# Altium schematic sheet Sheet3.SchDoc
size A3
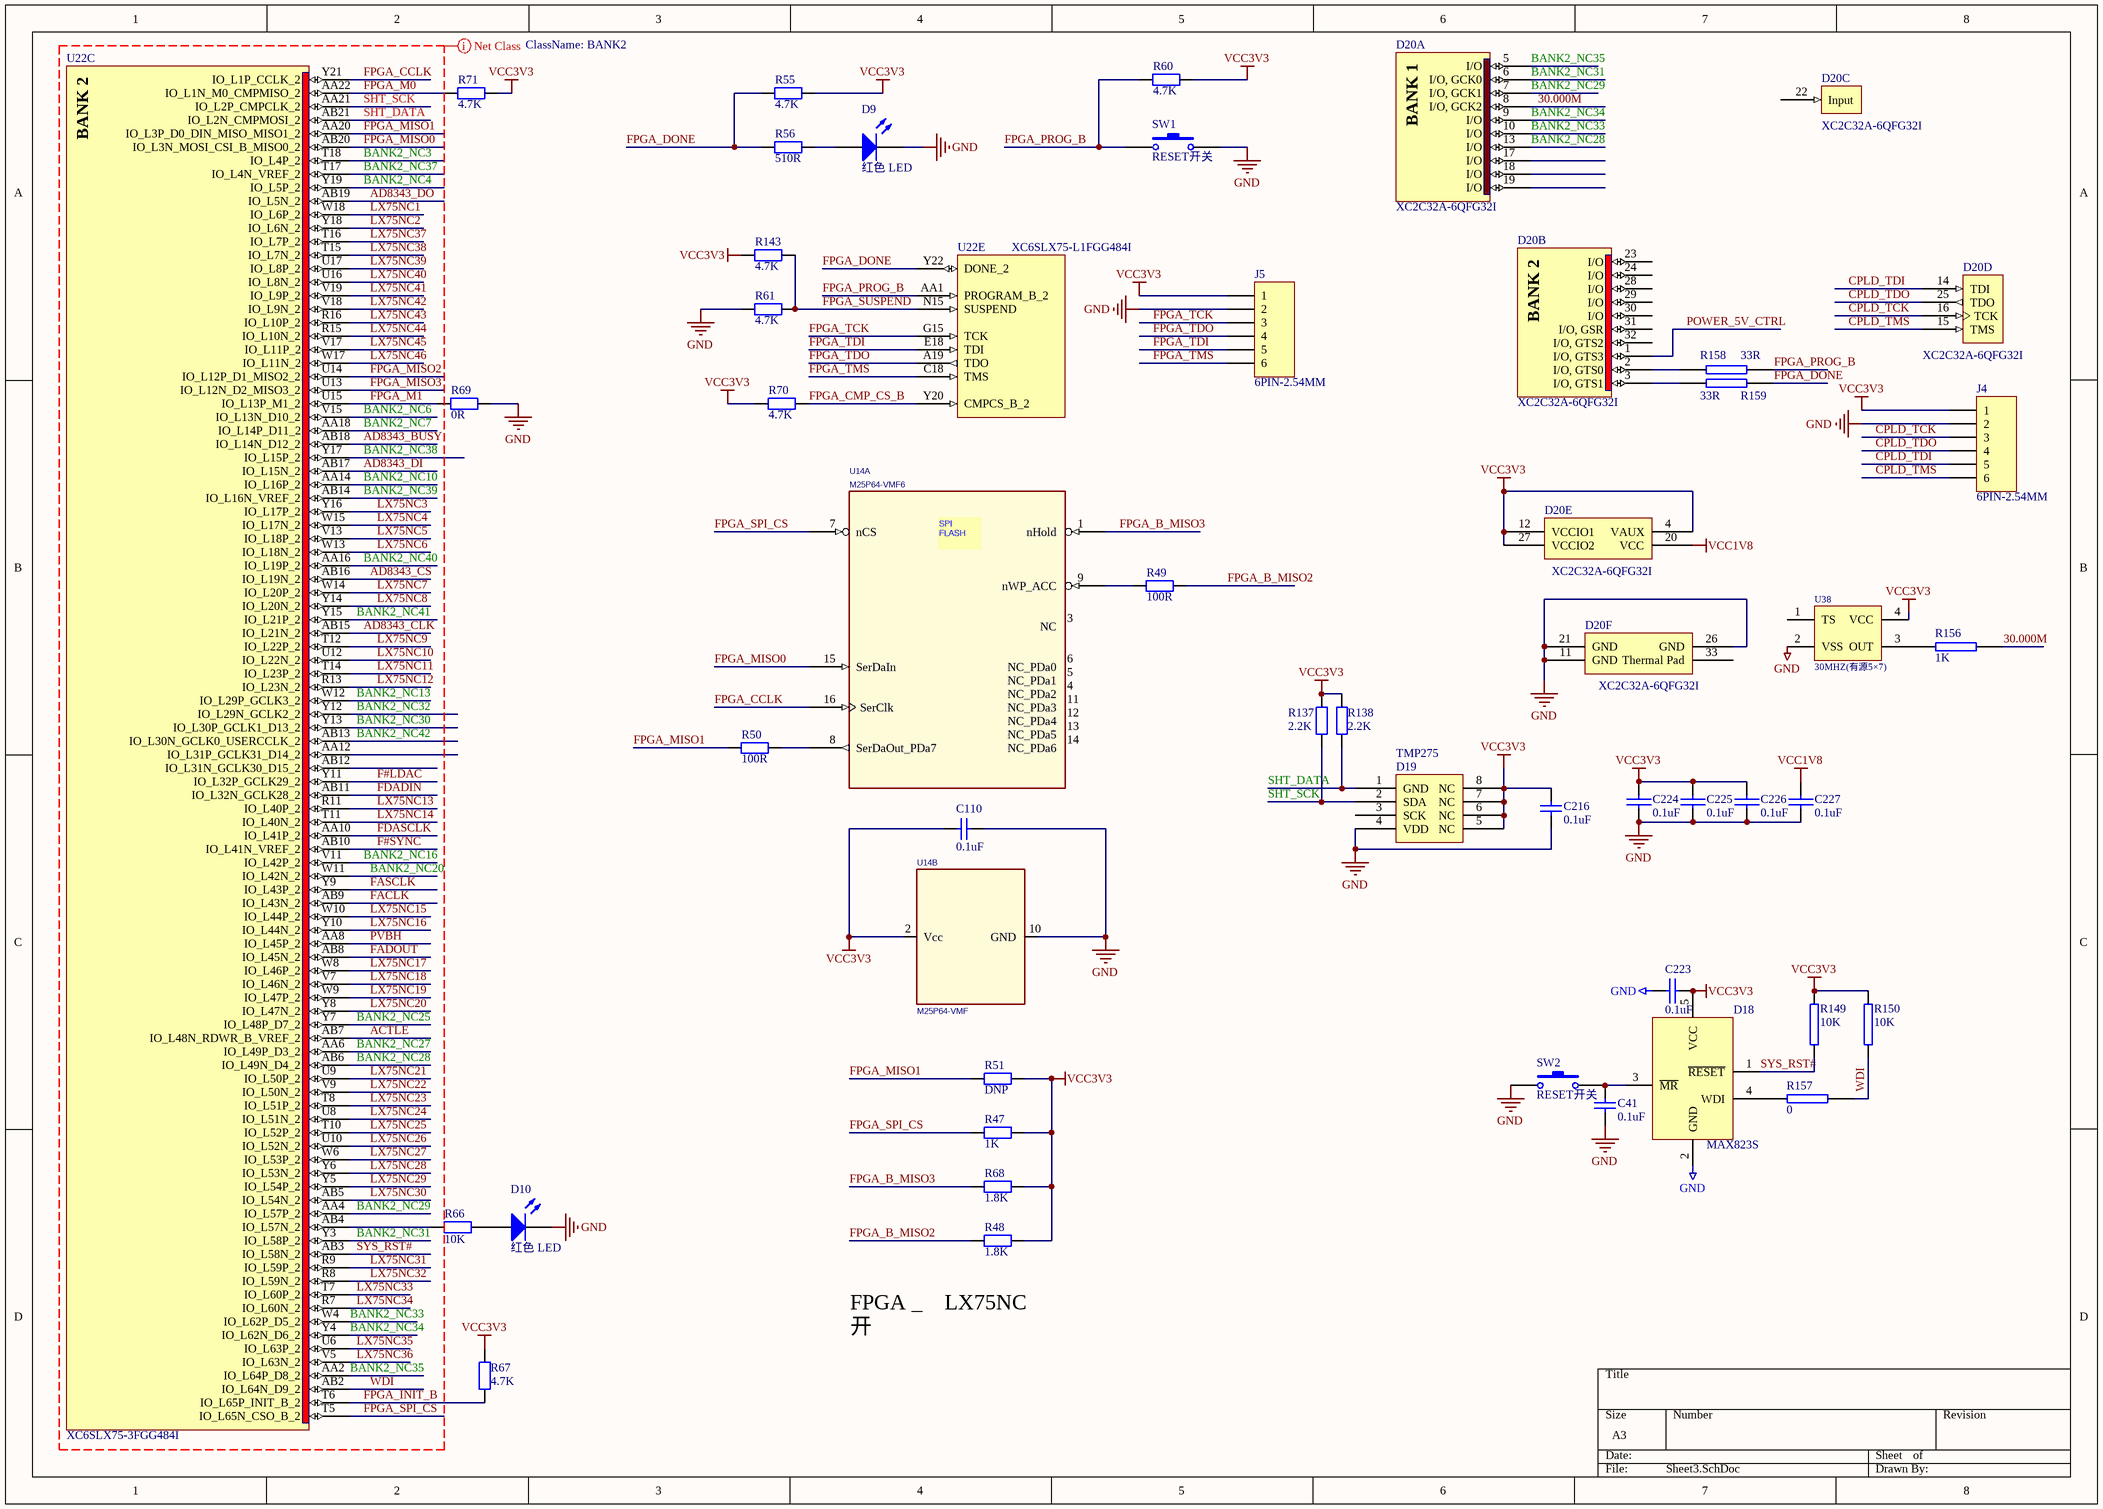
[diagram p0: Sheet3.SchDoc]

## Parts
C41  0.1uF  [0603C]
C110  0.1uF  [0402C]
C216  0.1uF  [0402C]
C223  0.1uF  [0603X]
C224  0.1uF  [0402C]
C225  0.1uF  [0402C]
C226  0.1uF  [0402C]
C227  0.1uF  [0402C]
D9  红色 LED  [0805LED]
D10  红色 LED  [0805LED]
D18  MAX823S  [MAX823]
D19  TMP275  [SMD8XX]
D20  XC2C32A-6QFG32I  [QFG32_N]  (parts A,B,C,D,E,F of 6)
J4  6PIN-2.54MM  [SIP6X]
J5  6PIN-2.54MM  [SIP6X]
R47  1K  [0603R]
R48  1.8K  [0603R]
R49  100R  [0603R]
R50  100R  [0603R]
R51  DNP  [0603R]
R55  4.7K  [0603R]
R56  510R  [0603R]
R60  4.7K  [0603R]
R61  4.7K  [0603R]
R66  10K  [0603R]
R67  4.7K  [0603R]
R68  1.8K  [0603R]
R69  0R  [0603R]
R70  4.7K  [0603R]
R71  4.7K  [0603R]
R137  2.2K  [0603R]
R138  2.2K  [0603R]
R143  4.7K  [0603R]
R149  10K  [0603X]
R150  10K  [0603X]
R156  1K  [0603]
R157  0  [0603]
R158  33R  [0603R]
R159  33R  [0603R]
SW1  RESET开关  [RESETKEY]
SW2  RESET开关  [RESETKEY]
U14  M25P64-VMF6  [SOIC16]  (parts A,B of 2)
U22  XC6SLX75-3FGG484I  [FGG484]  (parts C,E of 8)
U38  30MHZ(有源5×7)  [30M]

## Nets
GND: C41.1 C110.1 C216.1 C223.1 C224.1 C225.1 C226.1 C227.1 D9.2(K) D10.2(K) D18.2(GND) D19.4(VDD) D20.11(GND) D20.21(GND) D20.26(GND) J4.2 J5.2 R61.1 R69.1 SW1.2 SW2.1 U14.10(GND) U38.2(VSS)
VCC1V8: C227.2 D20.20(VCC)
VCC3V3: C110.2 C216.2 C223.2 C224.2 C225.2 C226.2 D18.5(VCC) D19.5(NC) D19.6(NC) D19.7(NC) D19.8(NC) D20.4(VAUX) D20.12(VCCIO1) D20.27(VCCIO2) J4.1 J5.1 R47.2 R48.2 R51.2 R55.2 R60.2 R67.1 R68.2 R70.1 R71.1 R137.1 R138.1 R143.1 R149.2 R150.2 U14.2(Vcc) U38.4(VCC)
30.000M: D20.8(I/O,_GCK2) R156.2
ACTLE: U22.AB7(IO_L48N_RDWR_B_VREF_2)
AD8343_BUSY: U22.AB18(IO_L14N_D12_2)
AD8343_CLK: U22.AB15(IO_L21N_2)
AD8343_CS: U22.AB16(IO_L19N_2)
AD8343_DI: U22.AB17(IO_L15N_2)
AD8343_DO: U22.AB19(IO_L5N_2)
BANK2_NC3: U22.T18(IO_L4P_2)
BANK2_NC4: U22.Y19(IO_L5P_2)
BANK2_NC6: U22.V15(IO_L13N_D10_2)
BANK2_NC7: U22.AA18(IO_L14P_D11_2)
BANK2_NC10: U22.AA14(IO_L16P_2)
BANK2_NC13: U22.W12(IO_L29P_GCLK3_2)
BANK2_NC16: U22.V11(IO_L42P_2)
BANK2_NC20: U22.W11(IO_L42N_2)
BANK2_NC25: U22.Y7(IO_L48P_D7_2)
BANK2_NC27: U22.AA6(IO_L49P_D3_2)
BANK2_NC28: D20.13(I/O) U22.AB6(IO_L49N_D4_2)
BANK2_NC29: D20.7(I/O,_GCK1) U22.AA4(IO_L57P_2)
BANK2_NC30: U22.Y13(IO_L30P_GCLK1_D13_2)
BANK2_NC31: D20.6(I/O,_GCK0) U22.Y3(IO_L58P_2)
BANK2_NC32: U22.Y12(IO_L29N_GCLK2_2)
BANK2_NC33: D20.10(I/O) U22.W4(IO_L62P_D5_2)
BANK2_NC34: D20.9(I/O) U22.Y4(IO_L62N_D6_2)
BANK2_NC35: D20.5(I/O) U22.AA2(IO_L64P_D8_2)
BANK2_NC37: U22.T17(IO_L4N_VREF_2)
BANK2_NC38: U22.Y17(IO_L15P_2)
BANK2_NC39: U22.AB14(IO_L16N_VREF_2)
BANK2_NC40: U22.AA16(IO_L19P_2)
BANK2_NC41: U22.Y15(IO_L21P_2)
BANK2_NC42: U22.AB13(IO_L30N_GCLK0_USERCCLK_2)
CPLD_TCK: D20.16(TCK) J4.3
CPLD_TDI: D20.14(TDI) J4.5
CPLD_TDO: D20.25(TDO) J4.4
CPLD_TMS: D20.15(TMS) J4.6
F#LDAC: U22.Y11(IO_L32P_GCLK29_2)
F#SYNC: U22.AB10(IO_L41N_VREF_2)
FACLK: U22.AB9(IO_L43N_2)
FADOUT: U22.AB8(IO_L45N_2)
FASCLK: U22.Y9(IO_L43P_2)
FDADIN: U22.AB11(IO_L32N_GCLK28_2)
FDASCLK: U22.AA10(IO_L41P_2)
FPGA_B_MISO2: R48.1 R49.2
FPGA_B_MISO3: R68.1 U14.1(nHold)
FPGA_CCLK: U14.16(SerClk) U22.Y21(IO_L1P_CCLK_2)
FPGA_CMP_CS_B: R70.2 U22.Y20(CMPCS_B_2)
FPGA_DONE: R55.1 R56.1 R159.2 U22.Y22(DONE_2)
FPGA_INIT_B: R67.2 U22.T6(IO_L65P_INIT_B_2)
FPGA_M0: R71.2 U22.AA22(IO_L1N_M0_CMPMISO_2)
FPGA_M1: R69.2 U22.U15(IO_L13P_M1_2)
FPGA_MISO0: U14.15(SerDaIn) U22.AB20(IO_L3N_MOSI_CSI_B_MISO0_2)
FPGA_MISO1: R50.1 R51.1 U22.AA20(IO_L3P_D0_DIN_MISO_MISO1_2)
FPGA_MISO2: U22.U14(IO_L12P_D1_MISO2_2)
FPGA_MISO3: U22.U13(IO_L12N_D2_MISO3_2)
FPGA_PROG_B: R60.1 R158.2 SW1.1 U22.AA1(PROGRAM_B_2)
FPGA_SPI_CS: R47.1 U14.7(nCS) U22.T5(IO_L65N_CSO_B_2)
FPGA_SUSPEND: R61.2 R143.2 U22.N15(SUSPEND)
FPGA_TCK: J5.3 U22.G15(TCK)
FPGA_TDI: J5.5 U22.E18(TDI)
FPGA_TDO: J5.4 U22.A19(TDO)
FPGA_TMS: J5.6 U22.C18(TMS)
LX75NC1: U22.W18(IO_L6P_2)
LX75NC2: U22.Y18(IO_L6N_2)
LX75NC3: U22.Y16(IO_L17P_2)
LX75NC4: U22.W15(IO_L17N_2)
LX75NC5: U22.V13(IO_L18P_2)
LX75NC6: U22.W13(IO_L18N_2)
LX75NC7: U22.W14(IO_L20P_2)
LX75NC8: U22.Y14(IO_L20N_2)
LX75NC9: U22.T12(IO_L22P_2)
LX75NC10: U22.U12(IO_L22N_2)
LX75NC11: U22.T14(IO_L23P_2)
LX75NC12: U22.R13(IO_L23N_2)
LX75NC13: U22.R11(IO_L40P_2)
LX75NC14: U22.T11(IO_L40N_2)
LX75NC15: U22.W10(IO_L44P_2)
LX75NC16: U22.Y10(IO_L44N_2)
LX75NC17: U22.W8(IO_L46P_2)
LX75NC18: U22.V7(IO_L46N_2)
LX75NC19: U22.W9(IO_L47P_2)
LX75NC20: U22.Y8(IO_L47N_2)
LX75NC21: U22.U9(IO_L50P_2)
LX75NC22: U22.V9(IO_L50N_2)
LX75NC23: U22.T8(IO_L51P_2)
LX75NC24: U22.U8(IO_L51N_2)
LX75NC25: U22.T10(IO_L52P_2)
LX75NC26: U22.U10(IO_L52N_2)
LX75NC27: U22.W6(IO_L53P_2)
LX75NC28: U22.Y6(IO_L53N_2)
LX75NC29: U22.Y5(IO_L54P_2)
LX75NC30: U22.AB5(IO_L54N_2)
LX75NC31: U22.R9(IO_L59P_2)
LX75NC32: U22.R8(IO_L59N_2)
LX75NC33: U22.T7(IO_L60P_2)
LX75NC34: U22.R7(IO_L60N_2)
LX75NC35: U22.U6(IO_L63P_2)
LX75NC36: U22.V5(IO_L63N_2)
LX75NC37: U22.T16(IO_L7P_2)
LX75NC38: U22.T15(IO_L7N_2)
LX75NC39: U22.U17(IO_L8P_2)
LX75NC40: U22.U16(IO_L8N_2)
LX75NC41: U22.V19(IO_L9P_2)
LX75NC42: U22.V18(IO_L9N_2)
LX75NC43: U22.R16(IO_L10P_2)
LX75NC44: U22.R15(IO_L10N_2)
LX75NC45: U22.V17(IO_L11P_2)
LX75NC46: U22.W17(IO_L11N_2)
POWER_5V_CTRL: D20.1(I/O,_GTS3)
PVBH: U22.AA8(IO_L45P_2)
SHT_DATA: D19.1(GND) R138.2 U22.AB21(IO_L2N_CMPMOSI_2)
SHT_SCK: D19.2(SDA) R137.2 U22.AA21(IO_L2P_CMPCLK_2)
SYS_RST#: D18.1(~{RESET}) R149.1 U22.AB3(IO_L58N_2)
WDI: R150.1 R157.2 U22.AB2(IO_L64N_D9_2)
NetC41_2: C41.2 D18.3(~{MR}) SW2.2
NetD9_1: D9.1(A) R56.2
NetD10_1: D10.1(A) R66.2
NetD18_4: D18.4(WDI) R157.1
NetD20_2: D20.2(I/O,_GTS0) R158.1
NetD20_3: D20.3(I/O,_GTS1) R159.1
NetR49_1: R49.1 U14.9(nWP_ACC)
NetR50_2: R50.2 U14.8(SerDaOut_PDa7)
NetR66_1: R66.1 U22.AB4(IO_L57N_2)
NetR156_1: R156.1 U38.3(OUT)

Not connected (* = marked no-connect by the designer): D19 3(SCK); D20 17(I/O) 18(I/O) 19(I/O) 22(Input) 23(I/O) 24(I/O) 28(I/O) 29(I/O) 30(I/O) 31(I/O,_GSR) 32(I/O,_GTS2) 33(Thermal_Pad); U14 3(NC) 4(NC_PDa2) 5(NC_PDa1) 6(NC_PDa0) 11(NC_PDa3) 12(NC_PDa4) 13(NC_PDa5) 14(NC_PDa6); U22 AA12(IO_L31P_GCLK31_D14_2) AB12(IO_L31N_GCLK30_D15_2); U38 1(TS)

## Layout directives
net class BANK2: ACTLE, AD8343_BUSY, AD8343_CLK, AD8343_CS, AD8343_DI, AD8343_DO, BANK2_NC3, BANK2_NC4, BANK2_NC6, BANK2_NC7, BANK2_NC10, BANK2_NC13, BANK2_NC16, BANK2_NC20, BANK2_NC25, BANK2_NC27, BANK2_NC28, BANK2_NC29, BANK2_NC30, BANK2_NC31, BANK2_NC32, BANK2_NC33, BANK2_NC34, BANK2_NC35, BANK2_NC37, BANK2_NC38, BANK2_NC39, BANK2_NC40, BANK2_NC41, BANK2_NC42, F#LDAC, F#SYNC, FACLK, FADOUT, FASCLK, FDADIN, FDASCLK, FPGA_CCLK, FPGA_INIT_B, FPGA_M0, FPGA_M1, FPGA_MISO0, FPGA_MISO1, FPGA_MISO2, FPGA_MISO3, FPGA_SPI_CS, LX75NC1, LX75NC2, LX75NC3, LX75NC4, LX75NC5, LX75NC6, LX75NC7, LX75NC8, LX75NC9, LX75NC10, LX75NC11, LX75NC12, LX75NC13, LX75NC14, LX75NC15, LX75NC16, LX75NC17, LX75NC18, LX75NC19, LX75NC20, LX75NC21, LX75NC22, LX75NC23, LX75NC24, LX75NC25, LX75NC26, LX75NC27, LX75NC28, LX75NC29, LX75NC30, LX75NC31, LX75NC32, LX75NC33, LX75NC34, LX75NC35, LX75NC36, LX75NC37, LX75NC38, LX75NC39, LX75NC40, LX75NC41, LX75NC42, LX75NC43, LX75NC44, LX75NC45, LX75NC46, PVBH, SHT_DATA, SHT_SCK, SYS_RST#, WDI

## Notes on the sheet
- (near R48) FPGA _    LX75NC 开
- (in symbol SPI FLASH 128Mb S25FL128P, part A) SPI / FLASH
- (in symbol XC2C32A-6QFG32C, part A) BANK 1
- (in symbol XC2C32A-6QFG32C, part B) BANK 2
- (in symbol XC6SLX45-L1FGG484I, part C) BANK 2

## Library data of the parts
C41 C110 C216 = Cap: Capacitor; Published: 8-Jun-2000; LatestRevisionDate: 17-Jul-2002; LatestRevisionNote: Re-released for DXP Platform.; PackageReference: RAD-0.3; Publisher: Altium Limited; Value: 0.1uF
C223-C227 = 2543.S01_104_49
D9 = LED2: Typical RED, GREEN, YELLOW, AMBER GaAs LED; Published: 8-Jun-2000; LatestRevisionDate: 17-Jul-2002; LatestRevisionNote: Re-released for DXP Platform.; PackageVersion: Feb-2002; PackageReference: 3.2X1.6X1.1; Publisher: Altium Limited
D10 = LED0: Typical INFRARED GaAs LED; Published: 8-Jun-2000; LatestRevisionDate: 08-Jul-2005; LatestRevisionNote: Mech Layer 1 removed.; PackageReference: LED-0; Publisher: Altium Limited
D18 = MAX823: MAX823复位监控芯片
D19 = SHT11
D20 = XC2C32A-6QFG32C: CoolRunner-II 1.8V, 32 Macrocell CPLD, 21 User I/Os, 32-Pin QFNL, Commercial Grade, Pb-Free; FirstPublished: 8-Jul-2005; LatestRevisionDate: 30-Oct-2009; LatestRevisionNote: Updated to datasheet version 3.1 Sep-2008.; DatasheetVersion: ver2.1, Nov-2008; PackageVersion: ver1.0, Aug-2004; PackageReference: QFG32; Publisher: Altium Limited; PackageDescription: 32-Pin Quad Flat No-Lead (QFG32) - Pb-Free; Supplier 1: Digi-Key; Supplier Part Number 1: 122-1412-ND; Code_JEDEC: MO-220; ComponentLink1Description: XC2C32A Datasheet; ComponentLink1URL: http://www.xilinx.com/support/documentation/data_sheets/ds310.pdf; ComponentLink2Description: QFG32 Package Drawing; ComponentLink2URL: http://www.xilinx.com/support/documentation/package_specs/qfg32.pdf; ComponentLink3Description: CoolRunner-II Documents; ComponentLink3URL: http://www.xilinx.com/support/documentation/coolrunner-ii.htm; ComponentLink4Description: Xilinx.com Home; ComponentLink4URL: http://www.xilinx.com
J4 J5 = Header 6: Header, 6-Pin; LatestRevisionDate: 17-Jul-2002; LatestRevisionNote: Re-released for DXP Platform.; Publisher: Altium Limited
R47-R51 R55 R60 R61 R66-R70 R143 = Res2: Resistor; Published: 8-Jun-2000; LatestRevisionDate: 17-Jul-2002; LatestRevisionNote: Re-released for DXP Platform.; PackageReference: AXIAL-0.4; Publisher: Altium Limited
  R47: Value: 1K
  R48 R68: Value: 1.8K
  R49 R50: Value: 100R
  R51: Value: DNP
  R55 R60 R61 R67 R70 R143: Value: 4.7K
  R66: Value: 10K
  R69: Value: 0R
R56 = Res2: Resistor; Value: 510; Published: 8-Jun-2000; LatestRevisionDate: 17-Jul-2002; LatestRevisionNote: Re-released for DXP Platform.; PackageReference: AXIAL-0.4; Publisher: Altium Limited
R71 = Res2: Resistor; Value: 4K7; Published: 8-Jun-2000; LatestRevisionDate: 17-Jul-2002; LatestRevisionNote: Re-released for DXP Platform.; PackageReference: AXIAL-0.4; Publisher: Altium Limited
R137 R138 = Res2: Resistor; Value: 100R; Published: 8-Jun-2000; LatestRevisionDate: 17-Jul-2002; LatestRevisionNote: Re-released for DXP Platform.; PackageReference: AXIAL-0.4; Publisher: Altium Limited
R149 R150 = RES2: 电阻
R156-R159 = RES2
SW1 SW2 = SW-PB: Switch; Published: 24-Mar-1999; LatestRevisionDate: 17-Jul-2002; LatestRevisionNote: Re-released for DXP Platform.; PackageReference: SPST-2; Publisher: Altium Limited
U14 = SPI FLASH 128Mb S25FL128P: SPI FLASH 128Mbit, 104MHz, 64kB sector; Full Part No: S25FL128P0XMFI00; Manufacturer: Spansion; Volts: 3.3V; ALS Lib: L0505; CLASS: IC; Type: SPI; Case: SOIC16
U22 = XC6SLX45-L1FGG484I: Spartan-6 LX 1.0V FPGA, 316 User I/Os, 484-Ball Fine-Pitch BGA (1.0mm Pitch), Low Power Version, Industrial Grade, Pb-Free; FirstPublished: 17-Nov-2009; DatasheetVersion: ver1.3, Nov-2009; PackageVersion: ver1.1, Dec-2008; PackageReference: FGG484; Publisher: Altium Limited; PackageDescription: 484-Ball Fine Pitch Ball Grid Array 1.00 mm Pitch (FGG484) - Pb-Free; Code_JEDEC: MS-034-AAJ-1; Code_IPC: BGA100P22X22-484; ComponentLink1Description: Spartan-6 Datasheet; ComponentLink1URL: http://www.xilinx.com/support/documentation/data_sheets/ds160.pdf; ComponentLink2Description: Pinout Specification; ComponentLink2URL: http://www.xilinx.com/support/documentation/user_guides/ug385.pdf; ComponentLink3Description: FGG484 Package Drawing; ComponentLink3URL: http://www.xilinx.com/support/documentation/package_specs/fg484.pdf; ComponentLink4Description: Spartan-6 Documents; ComponentLink4URL: http://www.xilinx.com/support/documentation/spartan-6.htm; ComponentLink5Description: Xilinx.com Home; ComponentLink5URL: http://www.xilinx.com
U38 = CRYSTAL